# EAGLE board V3s_LX9_AD9957_gps (EAGLE 7.2.0), part 1 of 2
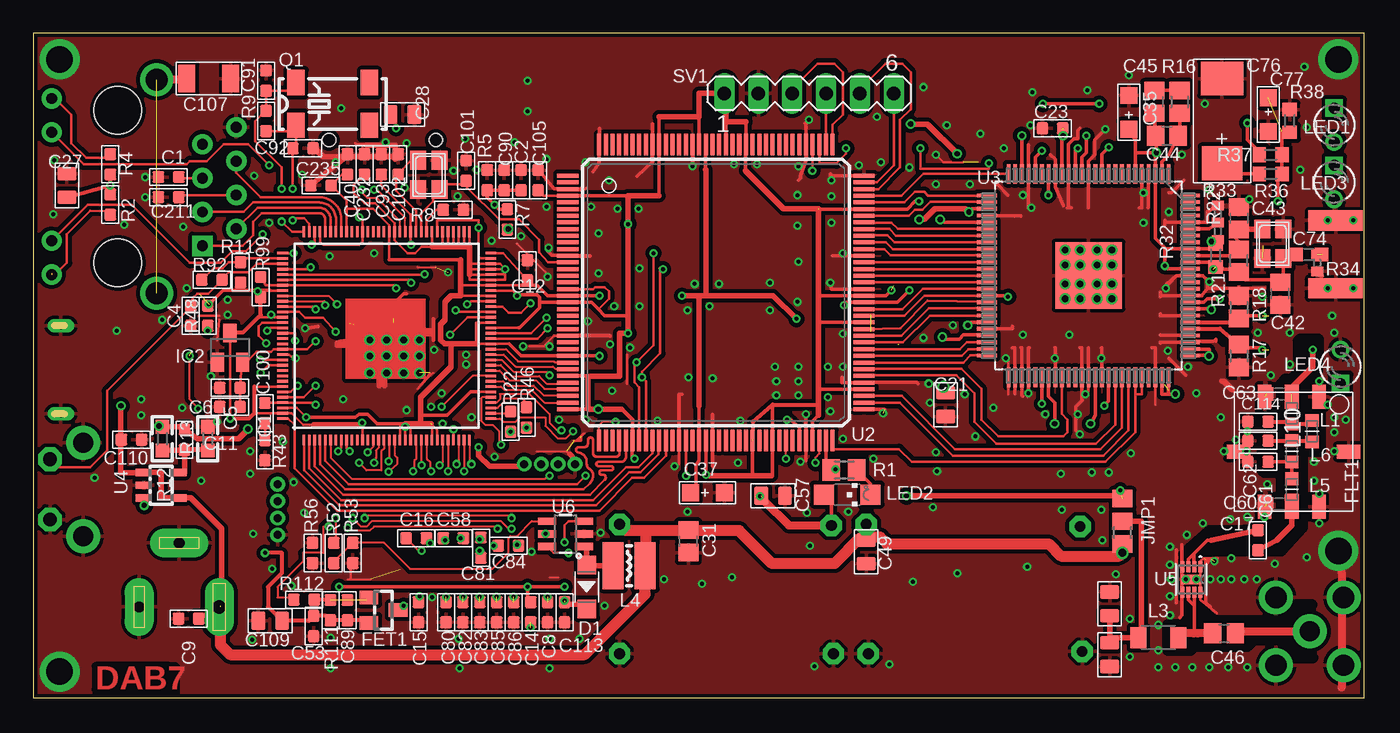
[diagram p3: board, top side]
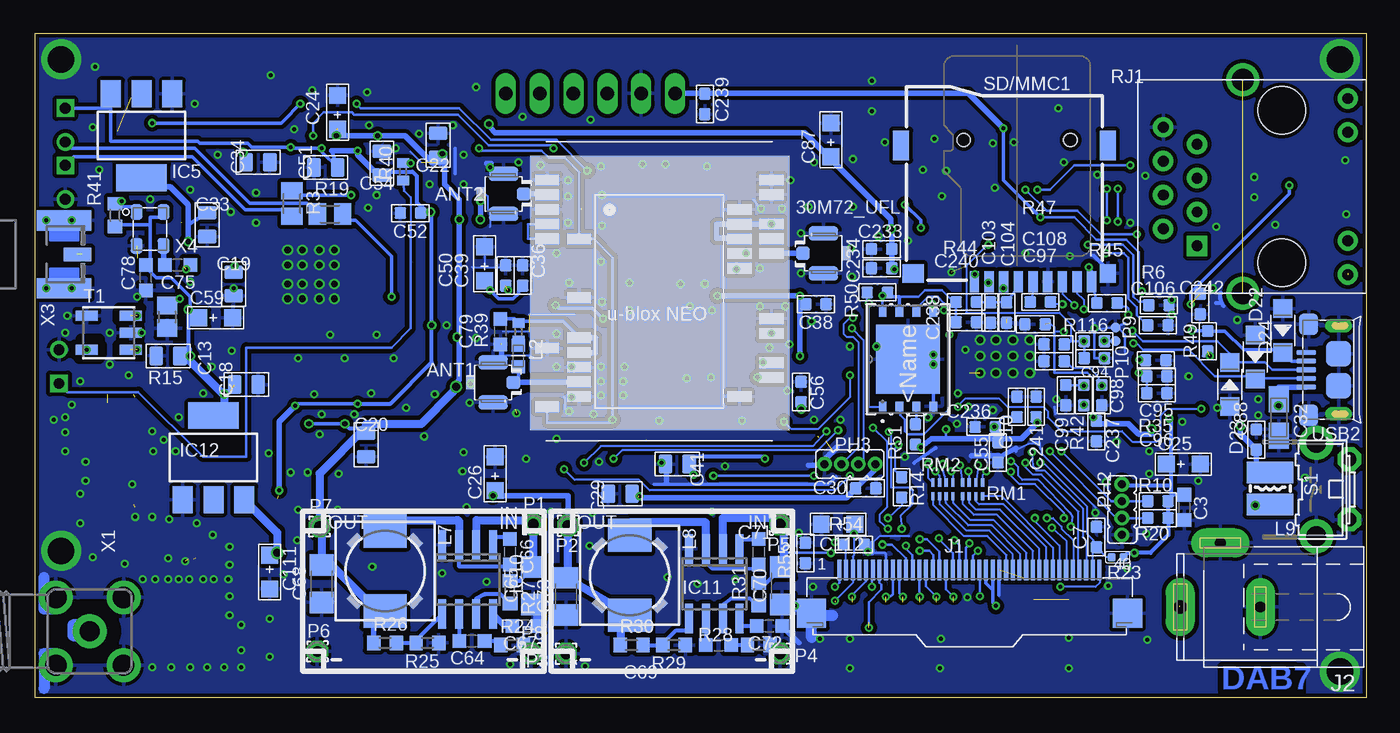
[diagram p4: board, bottom side, seen from below]

Size 99.8 x 49.8 mm. Coordinates in mm from the lower left corner, seen from the top.
Outline: 0,0 99.8,0 99.8,49.8 0,49.8 0,0
Copper layers (1*16): Top 0.035mm / dielectric 1.5mm / Bottom 0.035mm
Design rules "SeeedStudio_2layer_DRU_no_angle_20140221 *": minimum track width 6mil, minimum drill 0.3mm, track to track 6mil, track to pad 6mil, pad to pad 6mil, via to via 6mil, smd to smd 0mil, copper to edge 10mil, drill to drill 10mil, minimum pad ring 10mil, minimum via ring 6mil, stop-mask expansion 2mil, vias tented up to drill 100mil, thermal gap 10mil
tRestrict: area 4.8,0.4 to 10.7,2.4; 61 lines
bRestrict: area 93.8,3.6 to 96.6,6.4; area 4.8,0.4 to 10.7,2.4; 19 lines

## Footprints (pad centres in the part's own frame; a part is rotated, then mirrored left to right if it is on the bottom)
U-FL3P-SMD-2.6X2.6X1.0MM = smd 1.05 x 1: D -1.524,0 | smd 2.2 x 1.05: GND1 0,1.5; GND2 0,-1.5
C0603 = smd 0.889 x 0.889: 1 0,0.762; 2 0,-0.762
0603 = smd 1.016 x 1.016: 1 -0.953,0; 2 0.953,0
C0805 = smd 1.397 x 1.016: 1 0,0.889; 2 0,-0.889
AVX-A = smd 1.27 x 1.27: + -1.27,0; - 1.27,0
C0805' = smd 1.3 x 1.5: 1 -0.85,0; 2 0.85,0
A/3216-18R = smd 1.95 x 1.5: + 1.375,0; - -1.375,0
C1206 = smd 1.6 x 1.8: 1 -1.4,0; 2 1.4,0
AVX-D = smd 2.54 x 3.048: + -3.175,0 | smd 2.54 x 3.175: - 3.175,0
C1206' = smd 1.27 x 2.032: 1 -1.651,0; 2 1.651,0
SOD-123 = smd 1.397 x 1.397: + -1.651,0; - 1.651,0
SOT23 = smd 1.4 x 1: 1 1.1,-0.95; 2 1.1,0.95; 3 -1.1,0
GP731 = smd 1.016 x 1.778: 1 3.048,0.826; 2 5.08,0.826; 3 7.112,0.826; 5 7.112,9.081; 6 5.08,9.081; 7 3.048,9.081 | smd 1.778 x 1.016: 4 9.081,4.953; 8 0.826,4.953
ELQFP128 = smd 0.8 x 0.2: 1 -7.8,6.2; 2 -7.8,5.8; 3 -7.8,5.4; 4 -7.8,5; 5 -7.8,4.6; 6 -7.8,4.2; 7 -7.8,3.8; 8 -7.8,3.4; 9 -7.8,3; 10 -7.8,2.6; 11 -7.8,2.2; 12 -7.8,1.8; 13 -7.8,1.4; 14 -7.8,1; 15 -7.8,0.6; 16 -7.8,0.2; 17 -7.8,-0.2; 18 -7.8,-0.6; 19 -7.8,-1; 20 -7.8,-1.4; 21 -7.8,-1.8; 22 -7.8,-2.2; 23 -7.8,-2.6; 24 -7.8,-3; 25 -7.8,-3.4; 26 -7.8,-3.8; 27 -7.8,-4.2; 28 -7.8,-4.6; 29 -7.8,-5; 30 -7.8,-5.4; 31 -7.8,-5.8; 32 -7.8,-6.2; 65 7.8,-6.2; 66 7.8,-5.8; 67 7.8,-5.4; 68 7.8,-5; 69 7.8,-4.6; 70 7.8,-4.2; 71 7.8,-3.8; 72 7.8,-3.4; 73 7.8,-3; 74 7.8,-2.6; 75 7.8,-2.2; 76 7.8,-1.8; 77 7.8,-1.4; 78 7.8,-1; 79 7.8,-0.6; 80 7.8,-0.2; 81 7.8,0.2; 82 7.8,0.6; 83 7.8,1; 84 7.8,1.4; 85 7.8,1.8; 86 7.8,2.2; 87 7.8,2.6; 88 7.8,3; 89 7.8,3.4; 90 7.8,3.8; 91 7.8,4.2; 92 7.8,4.6; 93 7.8,5; 94 7.8,5.4; 95 7.8,5.8; 96 7.8,6.2 | smd 0.2 x 0.8: 33 -6.2,-7.8; 34 -5.8,-7.8; 35 -5.4,-7.8; 36 -5,-7.8; 37 -4.6,-7.8; 38 -4.2,-7.8; 39 -3.8,-7.8; 40 -3.4,-7.8; 41 -3,-7.8; 42 -2.6,-7.8; 43 -2.2,-7.8; 44 -1.8,-7.8; 45 -1.4,-7.8; 46 -1,-7.8; 47 -0.6,-7.8; 48 -0.2,-7.8; 49 0.2,-7.8; 50 0.6,-7.8; 51 1,-7.8; 52 1.4,-7.8; 53 1.8,-7.8; 54 2.2,-7.8; 55 2.6,-7.8; 56 3,-7.8; 57 3.4,-7.8; 58 3.8,-7.8; 59 4.2,-7.8; 60 4.6,-7.8; 61 5,-7.8; 62 5.4,-7.8; 63 5.8,-7.8; 64 6.2,-7.8; 97 6.2,7.8; 98 5.8,7.8; 99 5.4,7.8; 100 5,7.8; 101 4.6,7.8; 102 4.2,7.8; 103 3.8,7.8; 104 3.4,7.8; 105 3,7.8; 106 2.6,7.8; 107 2.2,7.8; 108 1.8,7.8; 109 1.4,7.8; 110 1,7.8; 111 0.6,7.8; 112 0.2,7.8; 113 -0.2,7.8; 114 -0.6,7.8; 115 -1,7.8; 116 -1.4,7.8; 117 -1.8,7.8; 118 -2.2,7.8; 119 -2.6,7.8; 120 -3,7.8; 121 -3.4,7.8; 122 -3.8,7.8; 123 -4.2,7.8; 124 -4.6,7.8; 125 -5,7.8; 126 -5.4,7.8; 127 -5.8,7.8; 128 -6.2,7.8
SOT23' = smd 1 x 1.4: 1 -0.95,-1.1; 2 0.95,-1.1; 3 0,1.1
SOT223 = smd 1.5 x 2: 1 -2.3,-3.15; 2 0,-3.15; 3 2.3,-3.15 | smd 3.8 x 2: 4 0,3.15
SO8 = smd 0.6 x 2.2: 1 -1.905,-2.6; 2 -0.635,-2.6; 3 0.635,-2.6; 4 1.905,-2.6; 5 1.905,2.6; 6 0.635,2.6; 7 -0.635,2.6; 8 -1.905,2.6
FPCE40-SMD-0.5-90D = smd 0.305 x 1.524: 1 -9.75,0; 2 -9.25,0; 3 -8.75,0; 4 -8.25,0; 5 -7.75,0; 6 -7.25,0; 7 -6.75,0; 8 -6.25,0; 9 -5.75,0; 10 -5.25,0; 11 -4.75,0; 12 -4.25,0; 13 -3.75,0; 14 -3.25,0; 15 -2.75,0; 16 -2.25,0; 17 -1.75,0; 18 -1.25,0; 19 -0.75,0; 20 -0.25,0; 21 0.25,0; 22 0.75,0; 23 1.25,0; 24 1.75,0; 25 2.25,0; 26 2.75,0; 27 3.25,0; 28 3.75,0; 29 4.25,0; 30 4.75,0; 31 5.25,0; 32 5.75,0; 33 6.25,0; 34 6.75,0; 35 7.25,0; 36 7.75,0; 37 8.25,0; 38 8.75,0; 39 9.25,0; 40 9.75,0 | smd 2.2 x 2.2: P1 -11.85,-3.25; P2 11.85,-3.25
SPC4077 = drill 0.8 pad 2.184 long: 1 -3,0; 2 0,-4.8 | drill 1 pad 2.184 long: 3 3,0
A0R-JMP = smd 1.5 x 1.3: 1 0,1.7; 2 0,0; 3 0,-1.7
INDC1608X95N = smd 0.95 x 1: 1 -0.8,0; 2 0.8,0
L3216C = smd 1.2 x 1.6: 1 -1.5,0; 2 1.5,0
CD32 = smd 3.5 x 1.6: 1 0,1.2; 2 0,-1.2
DR74 = smd 2.5 x 3.25: 1 -3,0; 2 3,0
LED2-2.54-D3.0MM = drill 0.813 square: A -1.27,0 | drill 0.813: K 1.27,0
CHIPLED_1206 = smd 1.5 x 1.5: A 0,-1.75; C 0,1.75
1,6/0,8 = drill 0.813 pad 1.6 octagon: 1 0,0
TESTPAD_30-ROUND = smd 0.762 x 0.762: 1 0,0
PH005-1-4 = drill 0.6 pad 0.9: 1 0,0; 2 1.27,0; 3 2.54,0; 4 3.81,0
MC-306 = smd 1.3 x 1.9: 1 -2.75,-1.6; 2 2.75,-1.6; 3 2.75,1.6; 4 -2.75,1.6
NX3225 = smd 1.4 x 1.2: 1 -1.1,-0.8; 2 1.1,-0.8; 3 1.1,0.8; 4 -1.1,0.8
M0805 = smd 1.3 x 1.6: 1 -0.95,0; 2 0.95,0
R0603 = smd 0.889 x 0.889: 1 0,0.762; 2 0,-0.762
R0603_5MIL_DWS = smd 1.016 x 1.016: 1 -0.889,0; 2 0.889,0
R0805 = smd 1.3 x 1.5: 1 -0.85,0; 2 0.85,0
R0603' = smd 1 x 1.1: 1 -0.85,0; 2 0.85,0
R0402 = smd 0.635 x 0.635: 1 0,0.445; 2 0,-0.445
R0402' = smd 0.7 x 0.9: 1 -0.65,0; 2 0.65,0
HR911105A = drill 0.813 pad 1.524: G+ 4.953,-6.604; G- 4.953,-4.064; GND -8.89,4.445; NC -6.35,3.175; P4 -8.89,-0.635; P5 -6.35,0.635; RD+ -6.35,-1.905; RD- -8.89,1.905; TD- -8.89,-3.175; Y+ 4.953,6.604; Y- 4.953,4.064 | drill 1.651 pad 2.159: SHIELD0 -2.921,8.001; SHIELD1 -2.921,-8.001 | drill 0.813 pad 1.524 square: TD+ -6.35,-4.445 | hole 3.556: 0,-5.715; 0,5.715
R_MATRIX_4_0402_25X625 = smd 0.25 x 0.625: 1.1 -0.75,-0.512; 1.2 -0.75,0.512; 2.1 -0.25,-0.512; 2.2 -0.25,0.512; 3.1 0.25,-0.512; 3.2 0.25,0.512; 4.1 0.75,-0.512; 4.2 0.75,0.512
B3F-31XX = drill 1.016 pad 1.778 octagon: 1 -2.261,-1.245; 2 2.261,-1.245 | drill 1.499 pad 2.54: 3 -3.505,1.245; 4 3.505,1.245
TFC-WPAPR-08 = smd 1.6 x 0.7: 1 -7.375,2.25; 2 -7.375,1.15; 3 -7.375,0.05; 4 -7.375,-1.05; 5 -7.375,-2.15; 6 -7.375,-3.25; 7 -7.375,-4.35; 8 -7.375,-5.45; 9 -7.375,-6.55 | smd 1.4 x 1.2: 10 -6.75,-7.75 | smd 1.4 x 1.6: 11 -6.75,6.85 | smd 2.2 x 1.2: 12 2.85,-7.75; 13 2.85,7.75 | hole 1: 3.25,-4.95; 3.25,3.05
MA06-1 = drill 1.016 long: 1 -6.35,0; 2 -3.81,0; 3 -1.27,0; 4 1.27,0; 5 3.81,0; 6 6.35,0
AT224-3 = smd 1.651 x 0.762: 1 1.638,1.27; 2 1.638,0; 3 1.638,-1.27; 4 -1.638,-1.27; 6 -1.638,1.27
MIC-VFDFPN-8_8X6-M = smd 0.711 x 0.584: 1 -3.543,1.905; 2 -3.543,0.635; 3 -3.543,-0.635; 4 -3.543,-1.905; 5 3.543,-1.905; 6 3.543,-0.635; 7 3.543,0.635; 8 3.543,1.905 | smd 5.156 x 4.801: 9 0,0
TQ144 = smd 1.6 x 0.3: P1 -11.1,8.75; P2 -11.1,8.25; P3 -11.1,7.75; P4 -11.1,7.25; P5 -11.1,6.75; P6 -11.1,6.25; P7 -11.1,5.75; P8 -11.1,5.25; P9 -11.1,4.75; P10 -11.1,4.25; P11 -11.1,3.75; P12 -11.1,3.25; P13 -11.1,2.75; P14 -11.1,2.25; P15 -11.1,1.75; P16 -11.1,1.25; P17 -11.1,0.75; P18 -11.1,0.25; P19 -11.1,-0.25; P20 -11.1,-0.75; P21 -11.1,-1.25; P22 -11.1,-1.75; P23 -11.1,-2.25; P24 -11.1,-2.75; P25 -11.1,-3.25; P26 -11.1,-3.75; P27 -11.1,-4.25; P28 -11.1,-4.75; P29 -11.1,-5.25; P30 -11.1,-5.75; P31 -11.1,-6.25; P32 -11.1,-6.75; P33 -11.1,-7.25; P34 -11.1,-7.75; P35 -11.1,-8.25; P36 -11.1,-8.75; P73 11.1,-8.75; P74 11.1,-8.25; P75 11.1,-7.75; P76 11.1,-7.25; P77 11.1,-6.75; P78 11.1,-6.25; P79 11.1,-5.75; P80 11.1,-5.25; P81 11.1,-4.75; P82 11.1,-4.25; P83 11.1,-3.75; P84 11.1,-3.25; P85 11.1,-2.75; P86 11.1,-2.25; P87 11.1,-1.75; P88 11.1,-1.25; P89 11.1,-0.75; P90 11.1,-0.25; P91 11.1,0.25; P92 11.1,0.75; P93 11.1,1.25; P94 11.1,1.75; P95 11.1,2.25; P96 11.1,2.75; P97 11.1,3.25; P98 11.1,3.75; P99 11.1,4.25; P100 11.1,4.75; P101 11.1,5.25; P102 11.1,5.75; P103 11.1,6.25; P104 11.1,6.75; P105 11.1,7.25; P106 11.1,7.75; P107 11.1,8.25; P108 11.1,8.75 | smd 0.3 x 1.6: P37 -8.75,-11.1; P38 -8.25,-11.1; P39 -7.75,-11.1; P40 -7.25,-11.1; P41 -6.75,-11.1; P42 -6.25,-11.1; P43 -5.75,-11.1; P44 -5.25,-11.1; P45 -4.75,-11.1; P46 -4.25,-11.1; P47 -3.75,-11.1; P48 -3.25,-11.1; P49 -2.75,-11.1; P50 -2.25,-11.1; P51 -1.75,-11.1; P52 -1.25,-11.1; P53 -0.75,-11.1; P54 -0.25,-11.1; P55 0.25,-11.1; P56 0.75,-11.1; P57 1.25,-11.1; P58 1.75,-11.1; P59 2.25,-11.1; P60 2.75,-11.1; P61 3.25,-11.1; P62 3.75,-11.1; P63 4.25,-11.1; P64 4.75,-11.1; P65 5.25,-11.1; P66 5.75,-11.1; P67 6.25,-11.1; P68 6.75,-11.1; P69 7.25,-11.1; P70 7.75,-11.1; P71 8.25,-11.1; P72 8.75,-11.1; P109 8.75,11.1; P110 8.25,11.1; P111 7.75,11.1; P112 7.25,11.1; P113 6.75,11.1; P114 6.25,11.1; P115 5.75,11.1; P116 5.25,11.1; P117 4.75,11.1; P118 4.25,11.1; P119 3.75,11.1; P120 3.25,11.1; P121 2.75,11.1; P122 2.25,11.1; P123 1.75,11.1; P124 1.25,11.1; P125 0.75,11.1; P126 0.25,11.1; P127 -0.25,11.1; P128 -0.75,11.1; P129 -1.25,11.1; P130 -1.75,11.1; P131 -2.25,11.1; P132 -2.75,11.1; P133 -3.25,11.1; P134 -3.75,11.1; P135 -4.25,11.1; P136 -4.75,11.1; P137 -5.25,11.1; P138 -5.75,11.1; P139 -6.25,11.1; P140 -6.75,11.1; P141 -7.25,11.1; P142 -7.75,11.1; P143 -8.25,11.1; P144 -8.75,11.1
QFP50P1600X1600X120-101N = smd 1.473 x 0.279: 1 -7.62,5.994; 2 -7.62,5.512; 3 -7.62,5.004; 4 -7.62,4.496; 5 -7.62,3.988; 6 -7.62,3.505; 7 -7.62,2.997; 8 -7.62,2.489; 9 -7.62,2.007; 10 -7.62,1.499; 11 -7.62,0.991; 12 -7.62,0.508; 13 -7.62,0; 14 -7.62,-0.508; 15 -7.62,-0.991; 16 -7.62,-1.499; 17 -7.62,-2.007; 18 -7.62,-2.489; 19 -7.62,-2.997; 20 -7.62,-3.505; 21 -7.62,-3.988; 22 -7.62,-4.496; 23 -7.62,-5.004; 24 -7.62,-5.512; 25 -7.62,-5.994; 51 7.62,-5.994; 52 7.62,-5.512; 53 7.62,-5.004; 54 7.62,-4.496; 55 7.62,-3.988; 56 7.62,-3.505; 57 7.62,-2.997; 58 7.62,-2.489; 59 7.62,-2.007; 60 7.62,-1.499; 61 7.62,-0.991; 62 7.62,-0.508; 63 7.62,0; 64 7.62,0.508; 65 7.62,0.991; 66 7.62,1.499; 67 7.62,2.007; 68 7.62,2.489; 69 7.62,2.997; 70 7.62,3.505; 71 7.62,3.988; 72 7.62,4.496; 73 7.62,5.004; 74 7.62,5.512; 75 7.62,5.994 | smd 0.279 x 1.473: 26 -5.994,-7.62; 27 -5.512,-7.62; 28 -5.004,-7.62; 29 -4.496,-7.62; 30 -3.988,-7.62; 31 -3.505,-7.62; 32 -2.997,-7.62; 33 -2.489,-7.62; 34 -2.007,-7.62; 35 -1.499,-7.62; 36 -0.991,-7.62; 37 -0.508,-7.62; 38 0,-7.62; 39 0.508,-7.62; 40 0.991,-7.62; 41 1.499,-7.62; 42 2.007,-7.62; 43 2.489,-7.62; 44 2.997,-7.62; 45 3.505,-7.62; 46 3.988,-7.62; 47 4.496,-7.62; 48 5.004,-7.62; 49 5.512,-7.62; 50 5.994,-7.62; 76 5.994,7.62; 77 5.512,7.62; 78 5.004,7.62; 79 4.496,7.62; 80 3.988,7.62; 81 3.505,7.62; 82 2.997,7.62; 83 2.489,7.62; 84 2.007,7.62; 85 1.499,7.62; 86 0.991,7.62; 87 0.508,7.62; 88 0,7.62; 89 -0.508,7.62; 90 -0.991,7.62; 91 -1.499,7.62; 92 -2.007,7.62; 93 -2.489,7.62; 94 -2.997,7.62; 95 -3.505,7.62; 96 -3.988,7.62; 97 -4.496,7.62; 98 -5.004,7.62; 99 -5.512,7.62; 100 -5.994,7.62 | smd 5.004 x 5.004: 101 0,0
SOT23-5 = smd 0.55 x 1.2: 1 -0.95,-1.3; 2 0,-1.3; 3 0.95,-1.3; 4 0.95,1.3; 5 -0.95,1.3
DFN-8_DC = smd 0.805 x 0.28: 1 -0.952,0.675; 2 -0.952,0.225; 3 -0.952,-0.225; 4 -0.952,-0.675; 5 0.952,-0.675; 6 0.952,-0.225; 7 0.952,0.225; 8 0.952,0.675 | smd 0.74 x 1.47: 9 0,0
SOT23-6 = smd 0.55 x 1.35: 1 -0.95,-1.375; 2 0,-1.375; 3 0.95,-1.375; 4 0.95,1.375; 5 0,1.375; 6 -0.95,1.375
NEO-M8 = smd 1.8 x 0.8: 3 6.4,-5.2; 7 6.4,-0.8; 8 6.4,2.2; 9 6.4,3.3; 10 6.4,4.4; 11 6.4,5.5; 12 6.4,6.6; 13 -5.6,6.6; 20 -5.6,-3; 21 -5.6,-4.1; 22 -5.6,-5.2; 23 -5.6,-6.3; 24 -5.6,-7.4
UBLOX_LEA-6T = smd 1.8 x 0.8: 3 8.4,-6.45; 4 8.4,-5.35; 6 8.4,-3.15; 7 8.4,-2.05; 9 8.4,2.85; 10 8.4,3.95; 11 8.4,5.05; 13 8.4,7.25; 14 8.4,8.35; 15 -8.4,8.35; 16 -8.4,7.25; 17 -8.4,6.15; 18 -8.4,5.05; 19 -8.4,3.95; 24 -8.4,-4.25; 28 -8.4,-8.65
MICRO-USB5+6P-SMD-0.65-B = smd 0.4 x 1.5: 1 -1.3,-0.25; 2 -0.65,-0.25; 3 0,-0.25; 4 0.65,-0.25; 5 1.3,-0.25 | smd 1.6 x 1.4: S1 -3.4,-0.427; S6 3.4,-0.427 | drill 0.508 pad 1.016 long: S2 -3.3,-2.675; S5 3.3,-2.675 | smd 1.9 x 1.9: S3 -1.2,-2.675; S4 1.2,-2.675
SMA90_DIP = drill 1.5 pad 2.54: ANTENNA 0,0 | drill 1.6 pad 2.54: GND1 -2.54,2.54; GND2 2.54,2.54; GND3 -2.54,-2.54; GND4 2.54,-2.54
W5500_LX9_AD9957_SMA_EDGELAUNCH_UFL = smd 4.064 x 1.524: GND@1 2.032,-2.54; GND@2 2.032,2.54 | smd 4.064 x 1.524 bottom: GND@3 2.032,2.54; GND@4 2.032,-2.54 | smd 2.032 x 1.016: P 3.048,0
X4-SMD-3.2X2.5X0.7MM = smd 1.143 x 0.889: 1 -1.27,-1.016; 2 1.27,-1.016; 3 1.27,1.016; 4 -1.27,1.016

## Placement (x,y rotation side)
30M72_UFL  U-FL  [U-FL3P-SMD-2.6X2.6X1.0MM]  40.7,33.32 0 bottom
ANT1  U-FL  [U-FL3P-SMD-2.6X2.6X1.0MM]  65.46,23.63 180 bottom
ANT2  U-FL  [U-FL3P-SMD-2.6X2.6X1.0MM]  64.67,37.76 180 bottom
C1  100nf  [C0603]  10.14,39.03 90 top
C2  100nf  [C0603]  36.57,38.79 0 top
C3  100n  [0603]  13.63,14.27 90 bottom
C4  1uF  [C0603]  11.81,28.63 0 top
C5  10UF 6.3V  [C0603]  14.74,23.24 90 top
C6  100nf  [C0603]  14.74,21.81 90 top
C7  100nf/NC  [C0603]  20.22,12.04 0 bottom
C8  2.2uf  [C0603]  38.56,6.41 0 top
C9  10uf  [C0603]  11.65,5.93 270 top
C10  10uf  [C0603]  26.17,21.81 180 bottom
C11  22pf  [C0603]  11.33,19.35 0 top
C12  10uf  [C0603]  37.05,32.05 180 top
C13  100nf  [C0805]  89.83,25.62 90 bottom
C14  1uf  [C0603]  37.29,6.41 180 top
C15  1uf  [C0603]  28.87,6.41 0 top
C16  2.2uf  [C0603]  28.71,11.96 90 top
C17  1nf  [C0603]  91.82,11.81 0 top
C18  100nf  [C0805]  83.96,23.47 90 bottom
C19  100nf  [C0805]  84.91,31.01 180 bottom
C20  100nf  [C0805]  74.99,18.95 0 bottom
C21  100nf  [C0805]  68.4,21.97 0 top
C22  100nf  [C0805]  69.59,41.41 180 bottom
C23  100nf  [C0603]  76.42,42.68 270 top
C24  10uf  [AVX-A]  77.13,43.87 90 bottom
C25  10uf  [AVX-A]  13.71,17.52 0 bottom
C26  10uf  [AVX-A]  65.31,16.81 90 bottom
C27  100nf  [C0805]  2.52,38.4 0 top
C28  100nf  [C0805]  27.68,43.71 270 top
C29  100nf  [C0805]  55.94,15.3 270 bottom
C30  100nf  [C0603]  37.52,15.7 90 bottom
C31  0,1  [C0805']  49.11,11.73 90 top
C32  4,7uF  [A/3216-18R]  6.57,21.01 90 bottom
C33  100nf  [C0805]  86.9,35.46 0 bottom
C34  100nf  [C0805]  83.09,40.14 90 bottom
C35  10uf  [AVX-A]  82.13,43.87 90 top
C36  10uf  [AVX-A]  66.1,32.52 90 bottom
C37  10uf  [AVX-A]  50.54,15.38 0 top
C38  100nf  [C0603]  41.25,29.51 270 bottom
C39  100nf  [C0603]  63.24,31.65 0 bottom
C40  100nf  [C0603]  23.55,39.98 0 top
C41  100nf  [C0805]  51.65,17.52 270 bottom
C42  27  [C0805']  93.48,30.3 270 top
C43  27  [C0805']  90.39,35.94 90 top
C44  43pF  [C0805']  84.99,42.13 0 top
C45  270pF  [C0805']  84.04,44.67 90 top
C46  75pF  [C0805']  89.28,4.82 0 top
C47  10uf  [C0805]  80.7,7.04 180 top
C48  100nf  [C0805]  80.7,3.23 0 top
C49  100nf  [C0805]  62.45,10.93 180 top
C50  100nf  [C0603]  64.51,31.65 180 bottom
C51  100nf  [C0805]  78.01,39.75 90 bottom
C52  100nf  [C0603]  71.66,36.33 270 bottom
C53  100nf  [C0603]  21.01,5.38 180 top
C54  100nf  [C0805]  73.8,40.06 180 bottom
C55  100nf  [C0603]  27.6,18.39 180 bottom
C56  100nf  [C0603]  42.37,22.92 180 bottom
C57  100nf  [C0805]  55.46,15.14 270 top
C58  1uf  [C0603]  31.49,11.96 90 top
C59  10uf  [AVX-A]  86.26,28.47 0 bottom
C60  16pF*  [0603]  93.4,14.51 0 top
C61  27pf  [C0603]  91.82,17.68 90 top
C62  27pf  [C0603]  91.82,19.27 90 top
C63  16pF*  [0603]  93.4,22.76 0 top
C64  3.9nF  [0603]  67.05,4.27 180 bottom
C65  10uF  [C1206]  62.45,8.39 90 bottom
C66  10nF  [0603]  64.19,10.93 270 bottom
C67  100nF  [0603]  63.08,5.38 180 bottom
C68  22uF  [C1206]  78.32,8.55 90 bottom
C69  3.9nF  [0603]  48.56,3.95 180 bottom
C70  10uF  [C1206]  43.79,8.39 90 bottom
C71  10nF  [0603]  45.54,10.93 270 bottom
C72  100nF  [0603]  44.75,5.38 180 bottom
C73  22uF  [C1206]  59.99,7.6 90 bottom
C74  10n (DNI)  [0603]  95.63,33.24 180 top
C75  10n  [0603]  89.12,32.44 0 bottom
C76  220uf  [AVX-D]  89.12,43.24 90 top
C77  10uf  [AVX-A]  92.61,43.71 270 top
C78  100n  [0603]  91.5,31.49 90 bottom
C79  100n  [0603]  64.91,27.44 90 bottom
C80  2.2uf  [C0603]  30.94,6.41 0 top
C81  1uf  [C0603]  33.55,11.25 0 top
C82  2.2uf  [C0603]  32.21,6.41 0 top
C83  2.2uf  [C0603]  33.48,6.41 0 top
C84  1uf  [C0603]  35.62,11.41 90 top
C85  1uf  [C0603]  34.75,6.41 0 top
C86  2.2uf  [C0603]  36.02,6.41 0 top
C87  10uf  [AVX-A]  40.14,41.81 90 bottom
C88  100nf  [C0603]  8.23,19.35 180 bottom
C89  100nf  [C0603]  23.55,6.57 0 top
C90  100nf  [C0603]  35.3,38.79 0 top
C91  18pf  [C0603]  17.44,46.25 180 top
C92  18pf  [C0603]  20.22,41.17 90 top
C93  10UF 6.3V  [C0603]  26.09,39.98 0 top
C94  100nF  [C0603]  20.38,25.46 90 bottom
C95  1UF 6.3V  [C0603]  15.78,25.3 90 bottom
C96  4.7uf  [C0603]  15.7,22.84 90 bottom
C97  10UF 6.3V  [C0603]  23.39,25.22 270 bottom
C98  100nF  [C0603]  19.82,22.68 180 bottom
C99  1uf  [C0603]  22.52,22.68 0 bottom
C100  100nF  [C0603]  17.36,21.33 0 top
C101  18pf  [C0603]  32.44,39.51 0 top
C102  18pf  [C0603]  27.36,39.98 180 top
C103  10UF 6.3V  [C0603]  28.16,28.87 180 bottom
C104  100nF  [C0603]  26.97,28.87 0 bottom
C105  100nf  [C0603]  37.84,38.79 0 top
C106  4.7UF 6.3V  [C0603]  15.62,27.92 90 bottom
C107  4.7nf 2000V  [C1206']  13.16,46.41 180 top
C108  100nF  [C0603]  23.39,26.49 270 bottom
C109  10uf  [C0805]  17.76,5.77 90 top
C110  1nf  [C0603]  7.36,19.35 270 top
C111  10uf  [AVX-A]  82.21,9.43 270 bottom
C112  10uf  [AVX-A]  39.59,13 180 bottom
C113  100nf 50V  [C0603]  39.83,6.41 180 top
C114  27pf  [C0603]  91.82,20.7 90 top
C211  100nf  [C0603]  10.14,37.52 90 top
C232  100nf  [C0603]  24.82,39.98 180 top
C233  100nf  [C0603]  36.33,33.63 270 bottom
C234  100nf  [C0603]  36.33,32.21 270 bottom
C235  100nf  [C0603]  21.57,38.4 90 top
C236  100nf  [C0603]  28.55,20.3 90 bottom
C237  100nf  [C0603]  20.22,19.98 180 bottom
C238  10UF 6.3V  [C0603]  24.82,28 90 bottom
C239  100nf  [C0603]  49.59,44.51 180 bottom
C240  100nf  [C0603]  29.98,28.16 270 bottom
C241  100nf  [C0603]  24.74,21.81 0 bottom
C242  10UF 6.3V  [C0603]  12.44,29.51 180 bottom
D1  XBS104S14  [SOD-123]  41.49,8.31 270 top
D22  CESD5V0D1  [SOD-123]  8.31,25.54 270 bottom
D23  CESD5V0D1  [SOD-123]  10.22,23.47 90 bottom
D24  CESD5V0D1  [SOD-123]  6.25,27.52 270 bottom
FET1  IRLML6402  [SOT23]  26.25,6.57 180 top
FLT1  RBP-204+  [GP731]  99.44,23.39 180 top
IC1  ALLWINNER_V3S  [ELQFP128]  26.49,27.13 90 top
IC2  XC6206  [SOT23']  14.74,26.25 0 top
IC5  LD117AS18TR  [SOT223]  91.82,42.13 180 bottom
IC10  MP2307  [SO8]  67.37,8.87 180 bottom
IC11  MP2307  [SO8]  48.87,8.55 180 bottom
IC12  LD117AS33TR  [SOT223]  86.42,18 0 bottom
J1  5922-4P-60P-0HD1R  [FPCE40-SMD-0.5-90D]  29.74,9.58 0 bottom
J2  [SPC4077]  10.93,6.81 180 bottom
JMP1  0R-JUMPA  [A0R-JMP]  81.66,13.24 180 top
L1  47nH*  [INDC1608X95N]  94.36,21.33 90 top
L2  33nH  [INDC1608X95N]  63.56,25.62 270 bottom
L3  1uH  [L3216C]  84.36,4.5 0 top
L4  10uH/1A/DCR<0.1R/CD32  [CD32]  44.67,9.9 270 top
L5  47nH*  [INDC1608X95N]  94.36,15.62 90 top
L6  56nH*  [INDC1608X95N]  94.36,18.47 90 top
L7  10uH  [DR74]  73.56,9.5 270 bottom
L8  10uH  [DR74]  55.22,9.19 270 bottom
L9  2.2uH/1.5A/DCR<0.1R/CD32  [CD32]  7.2,15.7 180 bottom
L10  56nH*  [INDC1608X95N]  95.86,19.98 90 top
LED1  CX-G302DC  [LED2-2.54-D3.0MM]  97.53,42.92 270 top
LED2  NOT_LOADED  [CHIPLED_1206]  61.02,15.22 270 top
LED3  CX-G302DC  [LED2-2.54-D3.0MM]  97.53,38.63 270 top
LED4  1PPS  [LED2-2.54-D3.0MM]  98.01,24.82 90 top
P1  [1,6/0,8]  62.45,13 0 bottom
P2  [1,6/0,8]  59.83,12.92 180 bottom
P3  [1,6/0,8]  59.99,3.31 180 bottom
P4  [1,6/0,8]  43.95,3.31 180 bottom
P5  [1,6/0,8]  43.95,13 180 bottom
P6  [1,6/0,8]  78.64,3.47 0 bottom
P7  [1,6/0,8]  78.48,12.84 0 bottom
P8  [1,6/0,8]  62.61,3.31 0 bottom
P9  TESTPADTESTPAD30/30  [TESTPAD_30-ROUND]  18.79,27.76 0 bottom
P10  TESTPADTESTPAD30/30  [TESTPAD_30-ROUND]  18.79,26.73 0 bottom
PH2  PH1X4-05  [PH005-1-4]  18.31,12.2 90 bottom
PH3  PH1X4-05  [PH005-1-4]  40.62,17.52 0 bottom
Q1  MC-306_32.768KHZ/SMD_8038/6pF  [MC-306]  22.44,44.51 0 top
Q2  24.576MHz  [NX3225]  92.93,34.03 90 top
Q3  24MHz  [NX3225]  29.67,39.19 90 top
R1  300  [M0805]  60.78,17.08 180 top
R2  330  [R0603]  5.77,36.97 180 top
R3  300  [M0805]  80.55,37.05 270 bottom
R4  330  [R0603]  5.77,39.98 0 top
R5  2K 1%  [R0603]  34.03,38.79 0 top
R6  6.04K 1%  [R0603]  15.54,29.43 90 bottom
R7  2K 1%  [R0603]  35.54,35.86 0 top
R8  240R 1%  [R0603]  31.49,36.57 90 top
R9  10M  [R0603]  17.44,43.24 0 top
R10  2K 1%  [R0603]  15.62,14.74 90 bottom
R11  0  [R0603]  15.54,31.89 0 top
R12  2k/1%  [R0603_5MIL_DWS]  9.66,19.43 270 top
R13  2k/1%  [R0603_5MIL_DWS]  13.08,19.43 90 top
R14  33R  [R0603]  34.82,15.78 180 bottom
R15  10k  [R0805]  89.91,28.55 270 bottom
R16  1,3K  [R0805]  85.94,44.67 270 top
R17  49,9  [R0805]  90.39,25.62 270 top
R18  49,9  [R0805]  90.39,29.27 270 top
R19  300  [M0805]  77.69,36.25 180 bottom
R20  2K 1%  [R0603]  15.62,13.47 90 bottom
R21  1M  [R0805]  90.39,32.76 90 top
R22  33R  [R0603]  35.78,20.7 180 top
R22*  47K (opt)  [R0603']  88.64,33.15 270 top
R23  10K  [R0402]  18.63,10.54 90 bottom
R24  6.8K  [R0603']  64.04,3.95 0 bottom
R25  8K2*  [R0603']  70.39,4.11 180 bottom
R26  7.87K* (for 1v8)  [R0603']  73.56,4.11 0 bottom
R27  10...100K  [R0603']  64.19,7.92 270 bottom
R28  6.8K  [R0603']  45.54,3.95 0 bottom
R29  8K2*  [R0603']  51.89,3.95 180 bottom
R30  21.5K* (for 3v3)  [R0603']  55.07,3.95 0 bottom
R31  10...100K  [R0603']  45.54,7.76 270 bottom
R32  0 (non-SFN)  [R0402']  88.8,34.98 270 top
R33  0 (install for SFN)  [R0402']  88.8,36.25 90 top
R34  50 (DNI)  [R0402']  96.26,32.6 270 top
R35  200K  [R0603]  15.7,24.11 270 bottom
R36  10k  [R0603']  92.77,39.27 0 top
R37  100k  [R0603']  92.77,40.7 180 top
R38  100k (optional)  [R0603']  94.2,43.24 270 top
R39  10R  [R0402']  63.56,27.44 90 bottom
R40  1K  [R0402']  72.21,39.43 90 bottom
R41  100k  [R0603']  93.8,36.17 270 bottom
R42  0  [R0603]  21.17,22.68 0 bottom
R43  200K  [R0603]  17.36,18.55 0 top
R44  2R2  [R0603]  29.98,29.67 270 bottom
R45  47K  [R0603]  19.43,29.59 270 bottom
R46  33R  [R0603]  36.97,21.01 180 top
R47  33R  [R0603]  24.43,29.67 90 bottom
R48  100K  [R0603]  13.08,28.63 0 top
R49  1K  [R0603]  11.89,26.73 0 bottom
R50  1K  [R0603]  36.65,30.38 90 bottom
R51  0  [R0603]  33.79,19.74 0 bottom
R52  0  [R0603]  22.52,10.85 180 top
R53  4,7K  [R0603]  23.95,10.85 0 top
R54  10R  [R0603]  38.4,11.49 270 bottom
R55  0  [R0603]  42.05,10.85 0 bottom
R56  0  [R0603]  20.93,10.85 0 top
R92  47K  [R0603]  13.39,31.33 90 top
R99  10K  [R0603]  17.04,30.78 180 top
R111  100K  [R0603]  22.28,6.57 180 top
R112  10K  [R0603]  20.3,7.36 270 top
R116  100K  [R0603]  20.38,26.73 90 bottom
RJ1  HR911105A  [HR911105A]  6.33,38.32 0 bottom
RM1  220R  [R_MATRIX_4_0402_25X625]  29.51,15.62 180 bottom
RM2  220R  [R_MATRIX_4_0402_25X625]  31.73,15.62 180 bottom
S1  RESET  [B3F-31XX]  2.5,15.62 90 bottom
SD/MMC1  MICRO_SD/MMC_CP_NEWTFC-WPAPR-08  [TFC-WPAPR-08]  27.13,38.56 90 bottom
SV1  JTAG  [MA06-1]  58.16,45.3 0 top
T1  TC1-1T+  [AT224-3]  94.28,27.36 0 bottom
U1  N25Q256A13EF840EMIC  [MIC-VFDFPN-8_8X6-M]  34.35,25.38 90 bottom
U2  6SLX9TQG144  [TQ144]  51.18,30.38 0 top
U3  AD9957BSVZ  [QFP50P1600X1600X120-101N]  79.12,31.65 270 top
U4  SY8008C(AA)C  [SOT23-5]  9.58,15.93 270 top
U5  LT3060EDC-1.8TRMPBF  [DFN-8_DC]  86.82,8.87 270 top
U6  LTC3426/SY7201/PT4103  [SOT23-6]  39.91,12.28 90 top
U10  NEO-M8  [NEO-M8]  52.6,29.19 180 bottom
U11  UBLOX_LEA-6  [UBLOX_LEA-6T]  53,30.46 0 bottom
USB2  10118193-0001LF  [MICRO-USB5+6P-SMD-0.65-B]  4.74,24.59 90 bottom
X1  RF_OUT  [SMA90_DIP]  95.71,4.98 90 bottom
X3  REF_IN  [W5500_LX9_AD9957_SMA_EDGELAUNCH_UFL]  99.67,33.24 0 bottom
X4  19.2MHZ  [X4-SMD-3.2X2.5X0.7MM]  91.18,35.14 270 bottom